# Altium project motordriver-v5.3.PrjPcb (part 3 of 3)
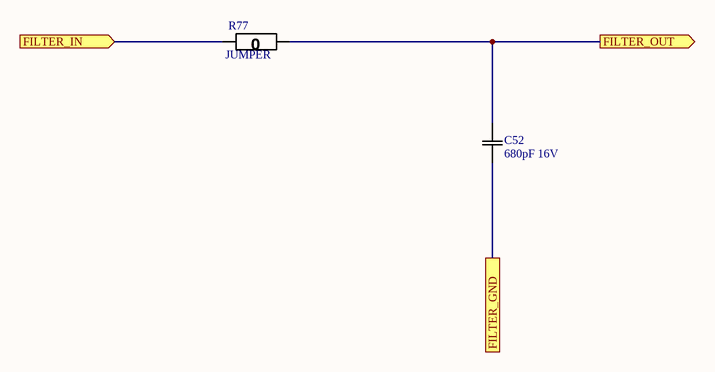
[diagram p14: low-pass-filter.SchDoc]

## Nets that join several sheets
5V: Trinamic Controller 0 (C15A.2 C16A.2 U7A.23), Current Amplification 0 (5 pins), power (6 pins), trinamic-controller-dribbler (6 pins), connectors-dribbler (J6.5), Current Amplification 4 (5 pins), Trinamic Controller 1 (C15B.2 C16B.2 U7B.23), Current Amplification 1 (5 pins), Trinamic Controller 2 (C15C.2 C16C.2 U7C.23), Current Amplification 2 (5 pins), Trinamic Controller 3 (C15D.2 C16D.2 U7D.23), Current Amplification 3 (5 pins)
GND: isolation-alt (C76.1 U15.9 U15.15), Driver Power Stage 0 (29 pins), Trinamic Controller 0 (37 pins), Connectors 0 (J5A.2), Current Amplification 0 (10 pins), power (12 pins), ui-jetson-nano (U2.7 U3.7 U4.7), UI-JETSON-NANO/U_isolation_0 (C4A.1 R15A.2 U5A.9 U5A.15), UI-JETSON-NANO/U_isolation_1 (C4B.1 R15B.2 U5B.9 U5B.15), UI-JETSON-NANO/U_isolation_2 (C4C.1 R15C.2 U5C.9 U5C.15), UI-JETSON-NANO/Demux 0 (U6A.4), UI-JETSON-NANO/Demux 1 (U6B.4), UI-JETSON-NANO/Demux 2 (U6C.4), UI-JETSON-NANO/Demux 3 (U6D.4), UI-JETSON-NANO/Demux 4 (U6E.4), UI-JETSON-NANO/U_isolation_3 (C4D.1 R15D.2 U5D.9 U5D.15), driver-power-stage-dribbler (29 pins), trinamic-controller-dribbler (33 pins), connectors-dribbler (J6.4), Current Amplification 4 (10 pins), Driver Power Stage 1 (29 pins), Trinamic Controller 1 (37 pins), Connectors 1 (J5B.2), Current Amplification 1 (10 pins), Driver Power Stage 2 (29 pins), Trinamic Controller 2 (37 pins), Connectors 2 (J5C.2), Current Amplification 2 (10 pins), Driver Power Stage 3 (29 pins), Trinamic Controller 3 (37 pins), Connectors 3 (J5D.2), Current Amplification 3 (10 pins)
JETSON_3V3: ui-jetson-nano (J2.14 J2.15), UI-JETSON-NANO/U_isolation_0 (C3A.2 U5A.1), UI-JETSON-NANO/U_isolation_1 (C3B.2 U5B.1), UI-JETSON-NANO/U_isolation_2 (C3C.2 U5C.1), UI-JETSON-NANO/U_isolation_3 (C3D.2 U5D.1)
JETSON_GND: ui-jetson-nano (J2.13), UI-JETSON-NANO/U_isolation_0 (C3A.1 R14A.2 U5A.2 U5A.8), UI-JETSON-NANO/U_isolation_1 (C3B.1 R14B.2 U5B.2 U5B.8), UI-JETSON-NANO/U_isolation_2 (C3C.1 R14C.2 U5C.2 U5C.8), UI-JETSON-NANO/U_isolation_3 (C3D.1 R14D.2 U5D.2 U5D.8)
VCC: Driver Power Stage 0 (23 pins), Trinamic Controller 0 (R18A.1), power (5 pins), driver-power-stage-dribbler (23 pins), trinamic-controller-dribbler (R43.1), Driver Power Stage 1 (23 pins), Trinamic Controller 1 (R18B.1), Driver Power Stage 2 (23 pins), Trinamic Controller 2 (R18C.1), Driver Power Stage 3 (23 pins), Trinamic Controller 3 (R18D.1)
VDD: isolation-alt (C76.2 U15.10 U15.16), Driver Power Stage 0 (C74A.1 R38A.2 U14A.16), Trinamic Controller 0 (22 pins), Connectors 0 (J5A.3), power (C2.2 R11.2 TP6.1 U1.2), ui-jetson-nano (13 pins), UI-JETSON-NANO/U_isolation_0 (C4A.2 U5A.16), UI-JETSON-NANO/U_isolation_1 (C4B.2 U5B.16), UI-JETSON-NANO/U_isolation_2 (C4C.2 U5C.16), UI-JETSON-NANO/Demux 0 (U6A.8), UI-JETSON-NANO/Demux 1 (U6B.8), UI-JETSON-NANO/Demux 2 (U6C.8), UI-JETSON-NANO/Demux 3 (U6D.8), UI-JETSON-NANO/Demux 4 (U6E.8), UI-JETSON-NANO/U_isolation_3 (C4D.2 U5D.16), driver-power-stage-dribbler (C74.1 R38.2 U14.16), trinamic-controller-dribbler (19 pins), Driver Power Stage 1 (C74B.1 R38B.2 U14B.16), Trinamic Controller 1 (22 pins), Connectors 1 (J5B.3), Driver Power Stage 2 (C74C.1 R38C.2 U14C.16), Trinamic Controller 2 (22 pins), Connectors 2 (J5C.3), Driver Power Stage 3 (C74D.1 R38D.2 U14D.16), Trinamic Controller 3 (22 pins), Connectors 3 (J5D.3)
CS0: ui-jetson-nano (J2.2), UI-JETSON-NANO/U_isolation_1 (U5B.4)
CS0_ISO: UI-JETSON-NANO/U_isolation_1 (U5B.13), UI-JETSON-NANO/Demux 0 (U6A.7)
CS1: ui-jetson-nano (J2.3), UI-JETSON-NANO/U_isolation_1 (U5B.5)
CS1_ISO: UI-JETSON-NANO/U_isolation_1 (U5B.12), UI-JETSON-NANO/Demux 1 (U6B.7)
CS2: ui-jetson-nano (J2.4), UI-JETSON-NANO/U_isolation_2 (U5C.3)
CS2_ISO: UI-JETSON-NANO/U_isolation_2 (U5C.14), UI-JETSON-NANO/Demux 2 (U6C.7)
CS3: ui-jetson-nano (J2.5), UI-JETSON-NANO/U_isolation_2 (U5C.4)
CS3_ISO: UI-JETSON-NANO/U_isolation_2 (U5C.13), UI-JETSON-NANO/Demux 3 (U6D.7)
CS4: ui-jetson-nano (J2.6), UI-JETSON-NANO/U_isolation_2 (U5C.5)
CS4_ISO: UI-JETSON-NANO/U_isolation_2 (U5C.12), UI-JETSON-NANO/Demux 4 (U6E.7)
CTRL_~{CS}: Trinamic Controller 0 (U7A.6), ui-jetson-nano (R1.2 U2.1), UI-JETSON-NANO/Demux 0 (U6A.1)
CTRL_~{CS}: ui-jetson-nano (R3.2 U2.10), UI-JETSON-NANO/Demux 1 (U6B.1), Trinamic Controller 1 (U7B.6)
CTRL_~{CS}: ui-jetson-nano (R5.2 U3.1), UI-JETSON-NANO/Demux 2 (U6C.1), Trinamic Controller 2 (U7C.6)
CTRL_~{CS}: ui-jetson-nano (R7.2 U3.10), UI-JETSON-NANO/Demux 3 (U6D.1), Trinamic Controller 3 (U7D.6)
CTRL_~{CS}E: ui-jetson-nano (R9.2 U4.1), UI-JETSON-NANO/Demux 4 (U6E.1), trinamic-controller-dribbler (U10.6)
CTRL_EN: ui-jetson-nano (J2.11), UI-JETSON-NANO/U_isolation_3 (U5D.3)
CTRL_EN_ISO: Trinamic Controller 0 (U7A.55), UI-JETSON-NANO/U_isolation_3 (U5D.14), trinamic-controller-dribbler (U10.55), Trinamic Controller 1 (U7B.55), Trinamic Controller 2 (U7C.55), Trinamic Controller 3 (U7D.55)
CUR_U_N: Trinamic Controller 0 (U7A.17), Current Amplification 0 (NT7A.1)
CUR_U_N: trinamic-controller-dribbler (U10.17), Current Amplification 4 (NT7B.1)
CUR_U_N: Trinamic Controller 1 (U7B.17), Current Amplification 1 (NT7C.1)
CUR_U_N: Trinamic Controller 2 (U7C.17), Current Amplification 2 (NT7D.1)
CUR_U_N: Trinamic Controller 3 (U7D.17), Current Amplification 3 (NT7E.1)
CUR_U_P: Trinamic Controller 0 (TP11A.1 U7A.16), Current Amplification 0 (C53A.2 R55A.2)
CUR_U_P: trinamic-controller-dribbler (TP20.1 U10.16), Current Amplification 4 (C53B.2 R55B.2)
CUR_U_P: Trinamic Controller 1 (TP11B.1 U7B.16), Current Amplification 1 (C53C.2 R55C.2)
CUR_U_P: Trinamic Controller 2 (TP11C.1 U7C.16), Current Amplification 2 (C53D.2 R55D.2)
CUR_U_P: Trinamic Controller 3 (TP11D.1 U7D.16), Current Amplification 3 (C53E.2 R55E.2)
CUR_W_N: Trinamic Controller 0 (U7A.19), Current Amplification 0 (NT8A.1)
CUR_W_N: trinamic-controller-dribbler (U10.19), Current Amplification 4 (NT8B.1)
CUR_W_N: Trinamic Controller 1 (U7B.19), Current Amplification 1 (NT8C.1)
CUR_W_N: Trinamic Controller 2 (U7C.19), Current Amplification 2 (NT8D.1)
CUR_W_N: Trinamic Controller 3 (U7D.19), Current Amplification 3 (NT8E.1)
CUR_W_P: Trinamic Controller 0 (TP12A.1 U7A.18), Current Amplification 0 (C56A.2 R56A.2)
CUR_W_P: trinamic-controller-dribbler (TP21.1 U10.18), Current Amplification 4 (C56B.2 R56B.2)
CUR_W_P: Trinamic Controller 1 (TP12B.1 U7B.18), Current Amplification 1 (C56C.2 R56C.2)
CUR_W_P: Trinamic Controller 2 (TP12C.1 U7C.18), Current Amplification 2 (C56D.2 R56D.2)
CUR_W_P: Trinamic Controller 3 (TP12D.1 U7D.18), Current Amplification 3 (C56E.2 R56E.2)
DRV_~{CS}: Driver Power Stage 0 (U14A.10), ui-jetson-nano (R2.2 U2.4), UI-JETSON-NANO/Demux 0 (U6A.2)
DRV_~{CS}: ui-jetson-nano (R4.2 U2.13), UI-JETSON-NANO/Demux 1 (U6B.2), Driver Power Stage 1 (U14B.10)
DRV_~{CS}: ui-jetson-nano (R6.2 U3.4), UI-JETSON-NANO/Demux 2 (U6C.2), Driver Power Stage 2 (U14C.10)
DRV_~{CS}: ui-jetson-nano (R8.2 U3.13), UI-JETSON-NANO/Demux 3 (U6D.2), Driver Power Stage 3 (U14D.10)
DRV_~{CS}: ui-jetson-nano (R10.2 U4.4), UI-JETSON-NANO/Demux 4 (U6E.2), driver-power-stage-dribbler (U14.10)
DRV_EN: Driver Power Stage 0 (U14A.24), Trinamic Controller 0 (U7A.32)
DRV_EN: driver-power-stage-dribbler (U14.24), trinamic-controller-dribbler (U10.32)
DRV_EN: Driver Power Stage 1 (U14B.24), Trinamic Controller 1 (U7B.32)
DRV_EN: Driver Power Stage 2 (U14C.24), Trinamic Controller 2 (U7C.32)
DRV_EN: Driver Power Stage 3 (U14D.24), Trinamic Controller 3 (U7D.32)
ENC_A: Trinamic Controller 0 (R32A.2 R35A.1), Connectors 0 (J5A.5 TP27A.1)
ENC_A: Trinamic Controller 1 (R32B.2 R35B.1), Connectors 1 (J5B.5 TP27B.1)
ENC_A: Trinamic Controller 2 (R32C.2 R35C.1), Connectors 2 (J5C.5 TP27C.1)
ENC_A: Trinamic Controller 3 (R32D.2 R35D.1), Connectors 3 (J5D.5 TP27D.1)
ENC_B: Trinamic Controller 0 (R33A.2 R36A.1), Connectors 0 (J5A.4 TP28A.1)
ENC_B: Trinamic Controller 1 (R33B.2 R36B.1), Connectors 1 (J5B.4 TP28B.1)
ENC_B: Trinamic Controller 2 (R33C.2 R36C.1), Connectors 2 (J5C.4 TP28C.1)
ENC_B: Trinamic Controller 3 (R33D.2 R36D.1), Connectors 3 (J5D.4 TP28D.1)
ENC_N: Trinamic Controller 0 (R34A.2 R37A.1), Connectors 0 (J5A.1 TP32A.1)
ENC_N: Trinamic Controller 1 (R34B.2 R37B.1), Connectors 1 (J5B.1 TP32B.1)
ENC_N: Trinamic Controller 2 (R34C.2 R37C.1), Connectors 2 (J5C.1 TP32C.1)
ENC_N: Trinamic Controller 3 (R34D.2 R37D.1), Connectors 3 (J5D.1 TP32D.1)
FAULT: Driver Power Stage 0 (R78A.1 U14A.23), Trinamic Controller 0 (U7A.70)
FAULT: driver-power-stage-dribbler (R78.1 U14.23), trinamic-controller-dribbler (U10.70)
FAULT: Driver Power Stage 1 (R78B.1 U14B.23), Trinamic Controller 1 (U7B.70)
FAULT: Driver Power Stage 2 (R78C.1 U14C.23), Trinamic Controller 2 (U7C.70)
FAULT: Driver Power Stage 3 (R78D.1 U14D.23), Trinamic Controller 3 (U7D.70)
HALL_UXE: trinamic-controller-dribbler (R47.2 R50.1), connectors-dribbler (J6.3)
HALL_VE: trinamic-controller-dribbler (R48.2 R51.1), connectors-dribbler (J6.2)
HALL_WYE: trinamic-controller-dribbler (R49.2 R52.1), connectors-dribbler (J6.1)
MISO: ui-jetson-nano (J2.9), UI-JETSON-NANO/U_isolation_0 (U5A.6)
MISO_CTRL0: Trinamic Controller 0 (U7A.9), ui-jetson-nano (U2.2)
MISO_CTRL1: ui-jetson-nano (U2.9), Trinamic Controller 1 (U7B.9)
MISO_CTRL2: ui-jetson-nano (U3.2), Trinamic Controller 2 (U7C.9)
MISO_CTRL3: ui-jetson-nano (U3.9), Trinamic Controller 3 (U7D.9)
MISO_CTRL4: ui-jetson-nano (U4.2), trinamic-controller-dribbler (U10.9)
MISO_DRV0: Driver Power Stage 0 (U14A.13), ui-jetson-nano (U2.5)
MISO_DRV1: ui-jetson-nano (U2.12), Driver Power Stage 1 (U14B.13)
MISO_DRV2: ui-jetson-nano (U3.5), Driver Power Stage 2 (U14C.13)
MISO_DRV3: ui-jetson-nano (U3.12), Driver Power Stage 3 (U14D.13)
MISO_DRV4: ui-jetson-nano (U4.5), driver-power-stage-dribbler (U14.13)
MISO_ISO: Connectors 0 (J8A.3 TP30A.1), ui-jetson-nano (10 pins), UI-JETSON-NANO/U_isolation_0 (U5A.11), Connectors 1 (J8B.3 TP30B.1), Connectors 2 (J8C.3 TP30C.1), Connectors 3 (J8D.3 TP30D.1)
MOSI: ui-jetson-nano (J2.10), UI-JETSON-NANO/U_isolation_0 (U5A.5)
MOSI_ISO: Driver Power Stage 0 (U14A.12), Trinamic Controller 0 (U7A.8), Connectors 0 (J8A.4 TP29A.1), UI-JETSON-NANO/U_isolation_0 (U5A.12), driver-power-stage-dribbler (U14.12), trinamic-controller-dribbler (U10.8), Driver Power Stage 1 (U14B.12), Trinamic Controller 1 (U7B.8), Connectors 1 (J8B.4 TP29B.1), Driver Power Stage 2 (U14C.12), Trinamic Controller 2 (U7C.8), Connectors 2 (J8C.4 TP29C.1), Driver Power Stage 3 (U14D.12), Trinamic Controller 3 (U7D.8), Connectors 3 (J8D.4 TP29D.1)
MUX_SEL_0: ui-jetson-nano (J2.1), UI-JETSON-NANO/U_isolation_1 (U5B.3)
MUX_SEL_1: ui-jetson-nano (J2.7), UI-JETSON-NANO/U_isolation_0 (U5A.3)
MUX_SEL_ISO_0: UI-JETSON-NANO/U_isolation_1 (U5B.14), UI-JETSON-NANO/Demux 0 (U6A.6), UI-JETSON-NANO/Demux 1 (U6B.6), UI-JETSON-NANO/Demux 2 (U6C.6), UI-JETSON-NANO/Demux 3 (U6D.6), UI-JETSON-NANO/Demux 4 (U6E.6)
MUX_SEL_ISO_1: UI-JETSON-NANO/U_isolation_0 (U5A.14), UI-JETSON-NANO/Demux 0 (U6A.5), UI-JETSON-NANO/Demux 1 (U6B.5), UI-JETSON-NANO/Demux 2 (U6C.5), UI-JETSON-NANO/Demux 3 (U6D.5), UI-JETSON-NANO/Demux 4 (U6E.5)
SCK: ui-jetson-nano (J2.8), UI-JETSON-NANO/U_isolation_0 (U5A.4)
SCK_ISO: Driver Power Stage 0 (U14A.11), Trinamic Controller 0 (U7A.7), Connectors 0 (J8A.2 TP31A.1), UI-JETSON-NANO/U_isolation_0 (U5A.13), driver-power-stage-dribbler (U14.11), trinamic-controller-dribbler (U10.7), Driver Power Stage 1 (U14B.11), Trinamic Controller 1 (U7B.7), Connectors 1 (J8B.2 TP31B.1), Driver Power Stage 2 (U14C.11), Trinamic Controller 2 (U7C.7), Connectors 2 (J8C.2 TP31C.1), Driver Power Stage 3 (U14D.11), Trinamic Controller 3 (U7D.7), Connectors 3 (J8D.2 TP31D.1)
U: Driver Power Stage 0 (R60A.1 TP13A.1), Connectors 0 (J3A.1)
U: driver-power-stage-dribbler (R60.2 TP13.1), connectors-dribbler (L1.2)
U: Driver Power Stage 1 (R60B.1 TP13B.1), Connectors 1 (J3B.1)
U: Driver Power Stage 2 (R60C.1 TP13C.1), Connectors 2 (J3C.1)
U: Driver Power Stage 3 (R60D.1 TP13D.1), Connectors 3 (J3D.1)
U_SENSE_N: Driver Power Stage 0 (R60A.S1), Current Amplification 0 (U12A.1)
U_SENSE_N: driver-power-stage-dribbler (R60.S2), Current Amplification 4 (U12B.1)
U_SENSE_N: Driver Power Stage 1 (R60B.S1), Current Amplification 1 (U12C.1)
U_SENSE_N: Driver Power Stage 2 (R60C.S1), Current Amplification 2 (U12D.1)
U_SENSE_N: Driver Power Stage 3 (R60D.S1), Current Amplification 3 (U12E.1)
U_SENSE_P: Driver Power Stage 0 (R60A.S2), Current Amplification 0 (U12A.8)
U_SENSE_P: driver-power-stage-dribbler (R60.S1), Current Amplification 4 (U12B.8)
U_SENSE_P: Driver Power Stage 1 (R60B.S2), Current Amplification 1 (U12C.8)
U_SENSE_P: Driver Power Stage 2 (R60C.S2), Current Amplification 2 (U12D.8)
U_SENSE_P: Driver Power Stage 3 (R60D.S2), Current Amplification 3 (U12E.8)
UH: Driver Power Stage 0 (U14A.14), Trinamic Controller 0 (U7A.39)
UH: driver-power-stage-dribbler (U14.14), trinamic-controller-dribbler (U10.39)
UH: Driver Power Stage 1 (U14B.14), Trinamic Controller 1 (U7B.39)
UH: Driver Power Stage 2 (U14C.14), Trinamic Controller 2 (U7C.39)
UH: Driver Power Stage 3 (U14D.14), Trinamic Controller 3 (U7D.39)
UL: Driver Power Stage 0 (U14A.15), Trinamic Controller 0 (U7A.40)
UL: driver-power-stage-dribbler (U14.15), trinamic-controller-dribbler (U10.40)
UL: Driver Power Stage 1 (U14B.15), Trinamic Controller 1 (U7B.40)
UL: Driver Power Stage 2 (U14C.15), Trinamic Controller 2 (U7C.40)
UL: Driver Power Stage 3 (U14D.15), Trinamic Controller 3 (U7D.40)
V: Driver Power Stage 0 (R66A.1 TP15A.1), Connectors 0 (J3A.2)
V: driver-power-stage-dribbler (R66.2 TP15.1), connectors-dribbler (L2.2)
V: Driver Power Stage 1 (R66B.1 TP15B.1), Connectors 1 (J3B.2)
V: Driver Power Stage 2 (R66C.1 TP15C.1), Connectors 2 (J3C.2)
V: Driver Power Stage 3 (R66D.1 TP15D.1), Connectors 3 (J3D.2)
VH: Driver Power Stage 0 (U14A.17), Trinamic Controller 0 (U7A.41)
VH: driver-power-stage-dribbler (U14.17), trinamic-controller-dribbler (U10.41)
VH: Driver Power Stage 1 (U14B.17), Trinamic Controller 1 (U7B.41)
VH: Driver Power Stage 2 (U14C.17), Trinamic Controller 2 (U7C.41)
VH: Driver Power Stage 3 (U14D.17), Trinamic Controller 3 (U7D.41)
VL: Driver Power Stage 0 (U14A.18), Trinamic Controller 0 (U7A.42)
VL: driver-power-stage-dribbler (U14.18), trinamic-controller-dribbler (U10.42)
VL: Driver Power Stage 1 (U14B.18), Trinamic Controller 1 (U7B.42)
VL: Driver Power Stage 2 (U14C.18), Trinamic Controller 2 (U7C.42)
VL: Driver Power Stage 3 (U14D.18), Trinamic Controller 3 (U7D.42)
W: Driver Power Stage 0 (R74A.1 TP17A.1), Connectors 0 (J3A.3)
W: driver-power-stage-dribbler (R74.2 TP17.1), connectors-dribbler (L3.2)
W: Driver Power Stage 1 (R74B.1 TP17B.1), Connectors 1 (J3B.3)
W: Driver Power Stage 2 (R74C.1 TP17C.1), Connectors 2 (J3C.3)
W: Driver Power Stage 3 (R74D.1 TP17D.1), Connectors 3 (J3D.3)
W_SENSE_N: Driver Power Stage 0 (R74A.S1), Current Amplification 0 (U13A.1)
W_SENSE_N: driver-power-stage-dribbler (R74.S2), Current Amplification 4 (U13B.1)
W_SENSE_N: Driver Power Stage 1 (R74B.S1), Current Amplification 1 (U13C.1)
W_SENSE_N: Driver Power Stage 2 (R74C.S1), Current Amplification 2 (U13D.1)
W_SENSE_N: Driver Power Stage 3 (R74D.S1), Current Amplification 3 (U13E.1)
W_SENSE_P: Driver Power Stage 0 (R74A.S2), Current Amplification 0 (U13A.8)
W_SENSE_P: driver-power-stage-dribbler (R74.S1), Current Amplification 4 (U13B.8)
W_SENSE_P: Driver Power Stage 1 (R74B.S2), Current Amplification 1 (U13C.8)
W_SENSE_P: Driver Power Stage 2 (R74C.S2), Current Amplification 2 (U13D.8)
W_SENSE_P: Driver Power Stage 3 (R74D.S2), Current Amplification 3 (U13E.8)
WH: Driver Power Stage 0 (U14A.19), Trinamic Controller 0 (U7A.46)
WH: driver-power-stage-dribbler (U14.19), trinamic-controller-dribbler (U10.46)
WH: Driver Power Stage 1 (U14B.19), Trinamic Controller 1 (U7B.46)
WH: Driver Power Stage 2 (U14C.19), Trinamic Controller 2 (U7C.46)
WH: Driver Power Stage 3 (U14D.19), Trinamic Controller 3 (U7D.46)
WL: Driver Power Stage 0 (U14A.20), Trinamic Controller 0 (U7A.47)
WL: driver-power-stage-dribbler (U14.20), trinamic-controller-dribbler (U10.47)
WL: Driver Power Stage 1 (U14B.20), Trinamic Controller 1 (U7B.47)
WL: Driver Power Stage 2 (U14C.20), Trinamic Controller 2 (U7C.47)
WL: Driver Power Stage 3 (U14D.20), Trinamic Controller 3 (U7D.47)
~ENC_CS0: Connectors 0 (J8A.1 TP33A.1), UI-JETSON-NANO/Demux 0 (U6A.3)
~ENC_CS1: UI-JETSON-NANO/Demux 1 (U6B.3), Connectors 1 (J8B.1 TP33B.1)
~ENC_CS2: UI-JETSON-NANO/Demux 2 (U6C.3), Connectors 2 (J8C.1 TP33C.1)
~ENC_CS3: UI-JETSON-NANO/Demux 3 (U6D.3), Connectors 3 (J8D.1 TP33D.1)
~RST: ui-jetson-nano (J2.12), UI-JETSON-NANO/U_isolation_3 (U5D.4)
~RST_ISO: Trinamic Controller 0 (U7A.50), UI-JETSON-NANO/U_isolation_3 (U5D.13), trinamic-controller-dribbler (U10.50), Trinamic Controller 1 (U7B.50), Trinamic Controller 2 (U7C.50), Trinamic Controller 3 (U7D.50)